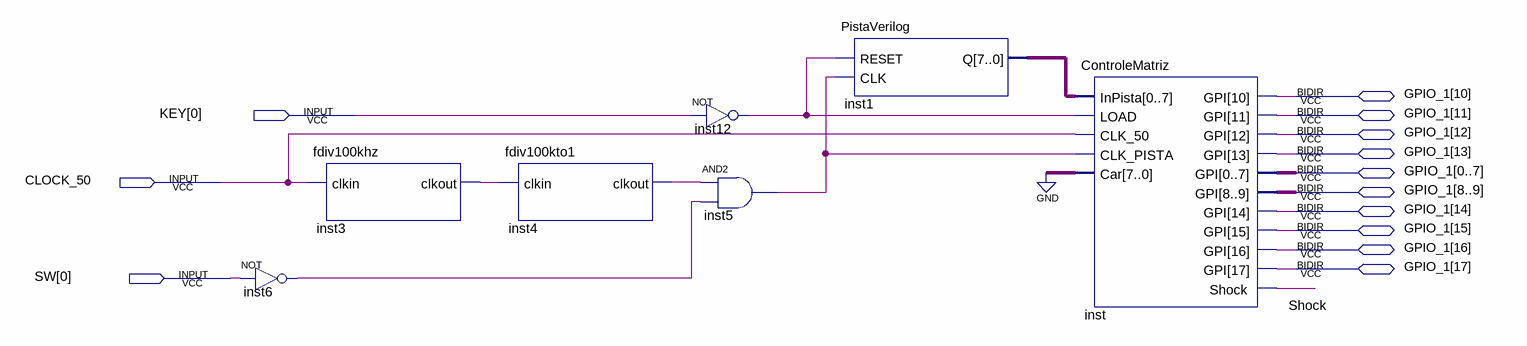
[diagram p0: schematic sheet]
// Quartus schematic RacingGame.bdf as structural Verilog: 7 symbols, 13 pins
module RacingGame (
  input  [0:0] KEY,
  input  CLOCK_50,
  input  [0:0] SW,
  inout  [0:17] GPIO_1
);

  wire inst3_clkout, inst4_clkout, inst5_out, inst6_out, inst12_out, Shock;
  wire [7:0] inst1_q;

  fdiv100khz inst3 (.clkin(CLOCK_50), .clkout(inst3_clkout));
  not inst6 (inst6_out, SW[0]);
  fdiv100kto1 inst4 (.clkin(inst3_clkout), .clkout(inst4_clkout));
  not inst12 (inst12_out, KEY[0]);
  and inst5 (inst5_out, inst4_clkout, inst6_out);
  PistaVerilog inst1 (.RESET(inst12_out), .CLK(inst5_out), .Q(inst1_q));
  ControleMatriz inst (
    .InPista(inst1_q), .LOAD(inst12_out), .CLK_50(CLOCK_50), .CLK_PISTA(inst5_out), .Car({8{1'b0}}),
    .Shock(Shock),
    .GPI({GPIO_1[17], GPIO_1[16], GPIO_1[15], GPIO_1[14], GPIO_1[13], GPIO_1[12], GPIO_1[11], GPIO_1[10], GPIO_1[9], GPIO_1[8], GPIO_1[7], GPIO_1[6], GPIO_1[5], GPIO_1[4], GPIO_1[3], GPIO_1[2], GPIO_1[1], GPIO_1[0]}));
endmodule
